# EAGLE design MEMS-preamp_v05 (EAGLE 8.5.0)
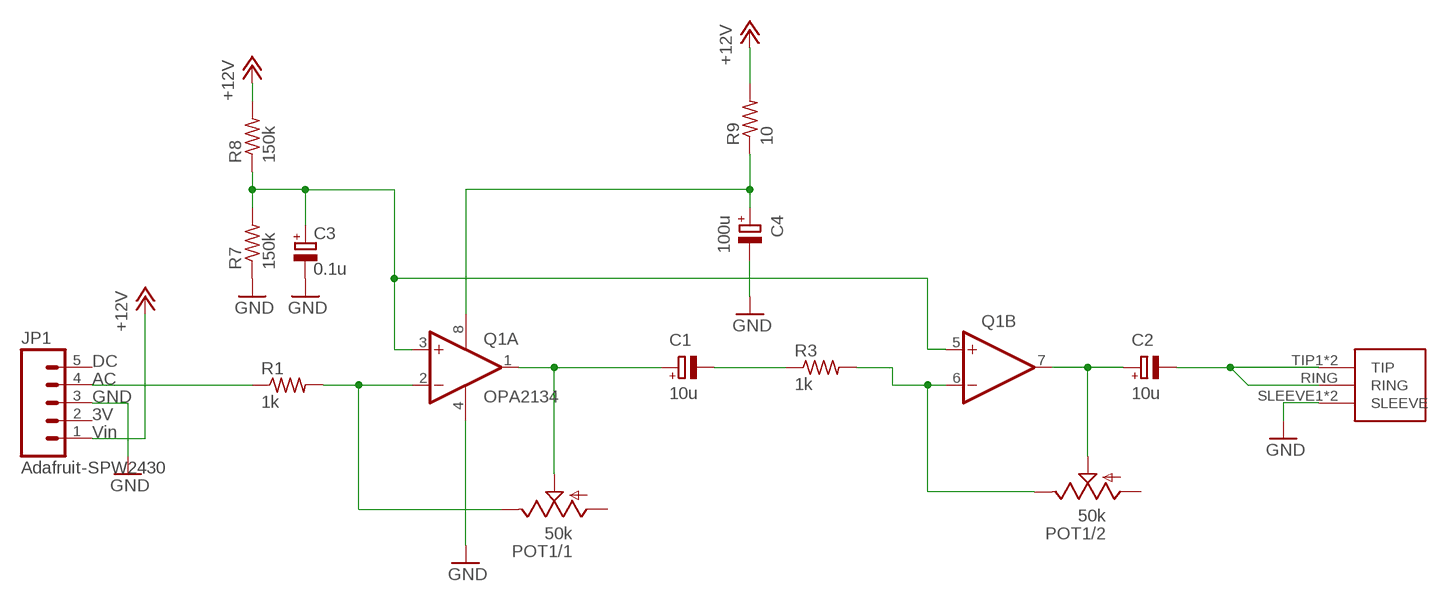
[diagram p0: schematic, sheet 1]

## Parts
C1  10u  CPOL-EUE2.5-5  [E2,5-5]
C2  10u  CPOL-EUE2.5-5  [E2,5-5]
C3  0.1u  CPOL-EUE2.5-5  [E2,5-5]
C4  100u  CPOL-EUE2.5-5  [E2,5-5]
JP1  Adafruit-SPW2430  M05LOCK  [1X05_LOCK]
POT1  50k  POT-DUAL-PTV112-4420  [PTV112]
Q1  OPA2134  OPA2134PA  [DIL08]
R1  1k  R-US_0204/5  [0204/5]
R3  1k  R-US_0204/5  [0204/5]
R7  150k  R-US_0204/5  [0204/5]
R8  150k  R-US_0204/5  [0204/5]
R9  10  R-US_0204/5  [0204/5]
U$1  1/8"-F-STEREO-PCB  [1/8"-F-STEREO-PCB]

## Nets
+12V: JP1.1 R8.2 R9.2
GND: C3.- C4.- JP1.3 Q1.4(A:V-) R7.1 U$1.SLEEVE1(SLEEVE) U$1.SLEEVE2(SLEEVE)
GROU[: POT1.2.3(/2:E) Q1.6(B:-IN) R3.2
N$1: C4.+ Q1.8(A:V+) R9.1
N$3: JP1.4 R1.1
N$4: C1.- R3.1
N$5: POT1.1.3(/1:E) Q1.2(A:-IN) R1.2
N$7: C2.- U$1.RING U$1.TIP1(TIP) U$1.TIP2(TIP)
N$8: C3.+ Q1.3(A:+IN) Q1.5(B:+IN) R7.2 R8.1
N$9: C1.+ POT1.1.2(/1:S) Q1.1(A:OUT)
N$10: C2.+ POT1.2.2(/2:S) Q1.7(B:OUT)
Unconnected: JP1.2 JP1.5 POT1.1.1(/1:A) POT1.2.1(/2:A)

## Library data of the parts
C1-C4 = rcl:CPOL-EU: POLARIZED CAPACITOR, European symbol
JP1 = SparkFun-Connectors:M05: Header 5 Standard 5-pin 0.1" header. Use with straight break away headers (SKU : PRT-00116), right angle break away headers (PRT-00553), swiss pins (PRT-00743), machine pins (PRT-00117), and female headers (PRT-00115). Molex polarized connector foot print use with SKU : PRT-08230 with associated crimp pins and housings.; CON1: Vin; CON2: 3V; CON3: GND; CON4: AC; CON5: DC
POT1 = CMU-ArtFab:POT-DUAL-PTV112: Bourns 11mm dual potentiometer; AVAILABILITY: Unavailable; DESCRIPTION: Alt# Tce-10111410; MF: STMicroelectronics; MP: PTV112; PACKAGE: None; PRICE: None
Q1 = linear:OPA2*: Dual Operational Amplifier Low Power, Single-Supply, Rail-To-Rail Operational Amplifier Source: http://focus.ti.com/lit/ds/symlink/opa2345.pdf http://focus.ti.com .. opa241.pdf http://focus.ti.com/lit/ds/symlink/opa2134.pdf; IC_NAME: OPA2134
R1 R3 R7-R9 = CMU-ArtFab:R-US_: RESISTOR, American symbol
U$1 = CMU-ArtFab:1/8"-F-STEREO-PCB

## Board
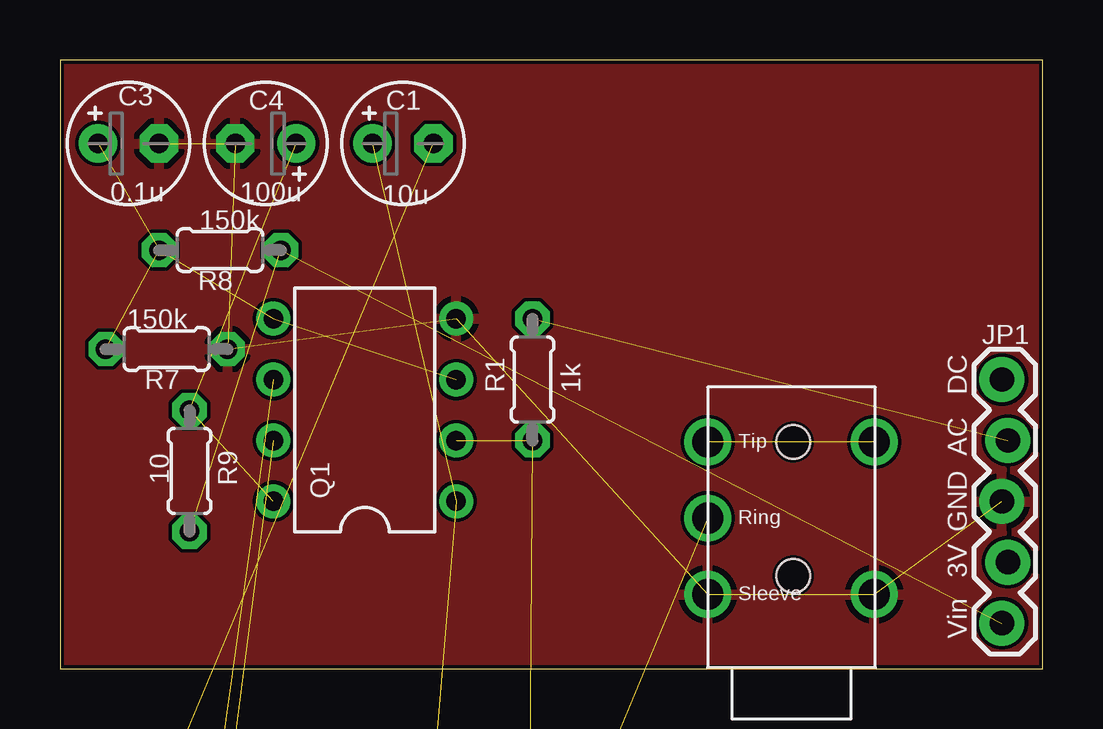
[diagram p1: board, top side]
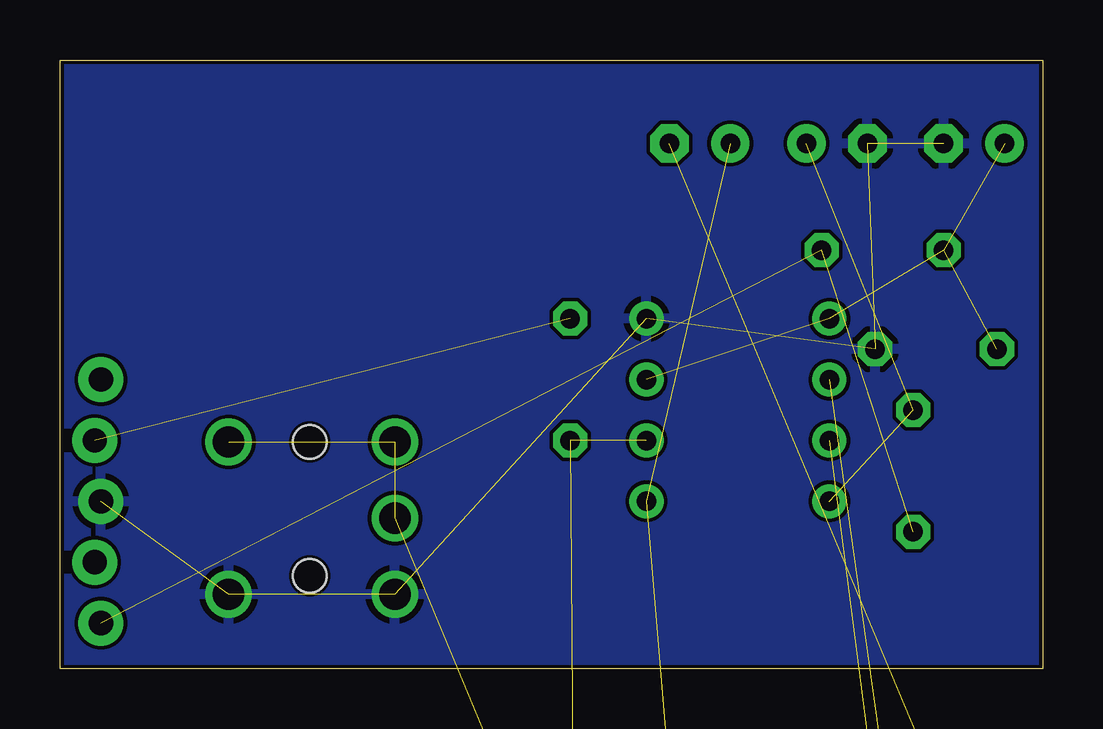
[diagram p2: board, bottom side, seen from below]

Size 40.95 x 25.39 mm. Coordinates in mm from the lower left corner, seen from the top.
Outline: 0,0 40.95,0 40.95,25.39 0,25.39 0,0
Copper layers (1*16): Top 0.035mm / dielectric 1.5mm / Bottom 0.035mm
Design rules "default *": minimum track width 6mil, minimum drill 6mil, track to track 6mil, track to pad 6mil, pad to pad 6mil, via to via 6mil, smd to smd 6mil, copper to edge 6mil, drill to drill 6mil, minimum pad ring 12mil, minimum via ring 12mil, stop-mask expansion 4mil, vias tented up to drill 0mil, thermal gap 10mil

### Footprints (pad centres in the part's own frame; a part is rotated, then mirrored left to right if it is on the bottom)
E2,5-5 = drill 0.813 pad 1.6: + -1.27,0 | drill 0.813 pad 1.6 octagon: - 1.27,0
1X05_LOCK = drill 1.016 pad 1.88: 1 0,0.127; 2 2.54,-0.127; 3 5.08,0.127; 4 7.62,-0.127; 5 10.16,0.127
PTV112 = drill 1.1 pad 1.676: 1.1 -3,-11; 1.2 -5,-11; 1.3 5,-11; 2.1 -1,-11; 2.2 1,-11; 2.3 3,-11 | drill 1.6 pad 2.8 square: M1 -6.8,0; M2 6.8,0
DIL08 = drill 0.813 pad 1.27: 1 -3.81,-3.81; 2 -1.27,-3.81; 3 1.27,-3.81; 4 3.81,-3.81; 5 3.81,3.81; 6 1.27,3.81; 7 -1.27,3.81; 8 -3.81,3.81
0204/5 = drill 0.813 octagon: 1 -2.54,0; 2 2.54,0
1/8"-F-STEREO-PCB = drill 1.3: RING 5.461,0; SLEEVE1 8.636,6.934; SLEEVE2 8.636,0; TIP1 2.286,6.934; TIP2 2.286,0 | hole 1.4: 2.286,3.556; 7.874,3.556

### Placement (x,y rotation side)
C1  14.29,21.91 0 top
C2  2.54,-49.53 0 top  (outside the outline)
C3  2.86,21.91 0 top
C4  8.57,21.91 180 top
JP1  39.37,1.91 90 top
POT1  13.97,-72.39 0 top  (outside the outline)
Q1  12.7,10.79 90 top
R1  19.68,12.06 270 top
R3  2.54,-15.24 0 top  (outside the outline)
R7  4.45,13.34 180 top
R8  6.67,17.46 0 top
R9  5.4,8.26 270 top
U$1  26.99,11.75 270 top

### Tracks (layer width: path | path; a pad name or v marks a point on that pad's centre or on a via)
+12V  (2 unrouted)
GND  (6 unrouted)
  pour Bottom: -2.54,-2.54 43.18,-2.54 43.18,27.94 -2.54,27.94
  pour Top: -1.27,26.67 41.91,26.67 41.91,-1.27 -1.27,-1.27
GROU[  (2 unrouted)
N$1  (2 unrouted)
N$3  (1 unrouted)
N$4  (1 unrouted)
N$5  (2 unrouted)
N$7  (3 unrouted)
N$8  (4 unrouted)
N$9  (2 unrouted)
N$10  (2 unrouted)